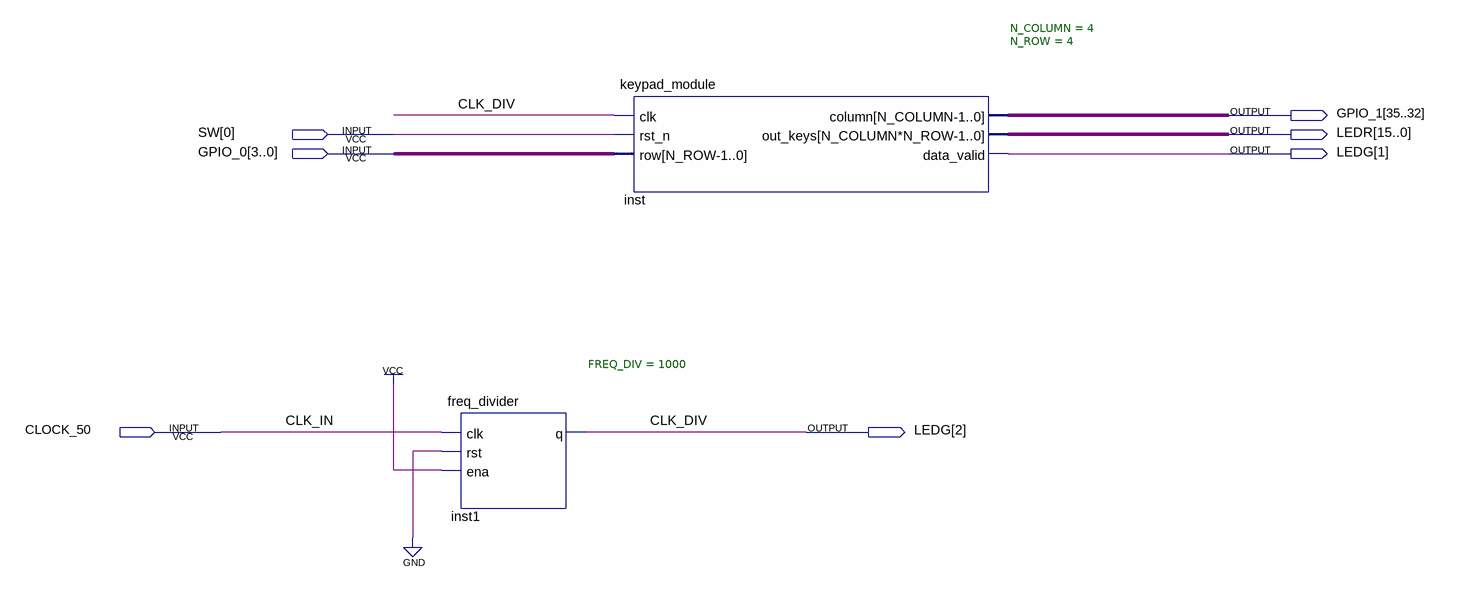
[diagram p0: schematic sheet]
// Quartus schematic keypad.bdf as structural Verilog: 2 symbols, 7 pins
module keypad (
  input  [0:0] SW,
  input  [3:0] GPIO_0,
  input  CLOCK_50,
  output [35:32] GPIO_1,
  output [15:0] LEDR,
  output [2:1] LEDG
);

  freq_divider #(.FREQ_DIV(1000)) inst1 (.clk(CLOCK_50), .rst(1'b0), .ena(1'b1), .q(LEDG[2]));
  keypad_module #(.N_COLUMN(4), .N_ROW(4)) inst (
    .clk(LEDG[2]), .rst_n(SW[0]), .row(GPIO_0), .column(GPIO_1), .out_keys(LEDR), .data_valid(LEDG[1]));

  // Other names for the same wires on the sheet: CLK_DIV = LEDG[2]; CLK_IN = CLOCK_50
endmodule
